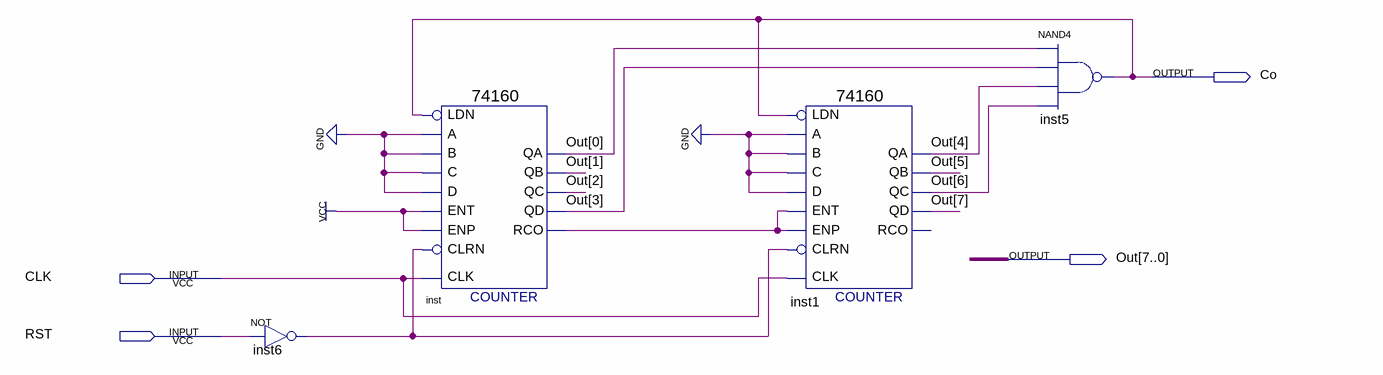
[diagram p0: schematic sheet]
// Quartus schematic Cnt_60.bdf as structural Verilog: 4 symbols, 4 pins
module Cnt_60 (
  input  CLK,
  input  RST,
  output Co,
  output [7:0] Out
);

  wire inst6_out, inst_rco;

  not inst6 (inst6_out, RST);
  \74160  inst (
    .CLK(CLK), .ENT(1'b1), .A(1'b0), .B(1'b0), .C(1'b0), .D(1'b0), .LDN(Co), .ENP(1'b1), .CLRN(inst6_out),
    .QD(Out[3]), .QA(Out[0]), .QB(Out[1]), .QC(Out[2]), .RCO(inst_rco));
  \74160  inst1 (
    .CLK(CLK), .ENT(inst_rco), .A(1'b0), .B(1'b0), .C(1'b0), .D(1'b0), .LDN(Co), .ENP(inst_rco),
    .CLRN(inst6_out), .QD(Out[7]), .QA(Out[4]), .QB(Out[5]), .QC(Out[6]));  // open: RCO
  nand inst5 (Co, Out[0], Out[3], Out[4], Out[6]);
endmodule
